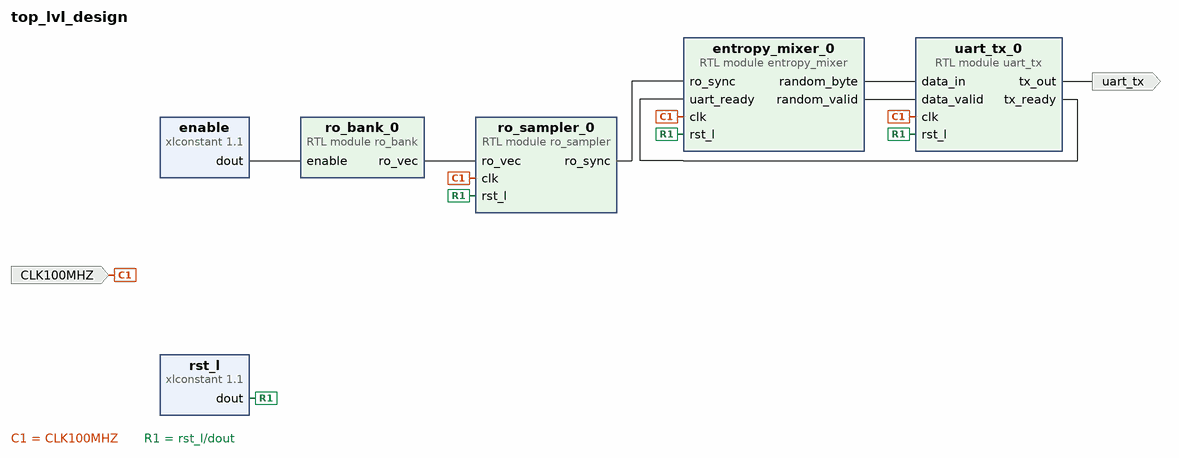
[diagram p0: block diagram of the top level]
# Vivado block design top_lvl_design, xc7s25csga324-1, Vivado 2025.2
create_bd_design top_lvl_design

create_bd_port -dir I -type clk CLK100MHZ
set_property -dict {CONFIG.FREQ_HZ 100000000} [get_bd_ports CLK100MHZ]
create_bd_port -dir O uart_tx

create_bd_cell -type module -reference ro_bank ro_bank_0
create_bd_cell -type module -reference uart_tx uart_tx_0
create_bd_cell -type module -reference ro_sampler ro_sampler_0
create_bd_cell -type ip -vlnv xilinx.com:ip:xlconstant:1.1 rst_l
set_property -dict {CONFIG.CONST_VAL 1} [get_bd_cells rst_l]
create_bd_cell -type ip -vlnv xilinx.com:ip:xlconstant:1.1 enable
create_bd_cell -type module -reference entropy_mixer entropy_mixer_0

# ---- connections ----

connect_bd_net [get_bd_ports CLK100MHZ] [get_bd_pins uart_tx_0/clk] [get_bd_pins ro_sampler_0/clk] [get_bd_pins entropy_mixer_0/clk]
connect_bd_net [get_bd_pins enable/dout] [get_bd_pins ro_bank_0/enable]
connect_bd_net [get_bd_pins entropy_mixer_0/random_byte] [get_bd_pins uart_tx_0/data_in]
connect_bd_net [get_bd_pins entropy_mixer_0/random_valid] [get_bd_pins uart_tx_0/data_valid]
connect_bd_net [get_bd_pins ro_bank_0/ro_vec] [get_bd_pins ro_sampler_0/ro_vec]
connect_bd_net [get_bd_pins ro_sampler_0/ro_sync] [get_bd_pins entropy_mixer_0/ro_sync]
connect_bd_net [get_bd_pins rst_l/dout] [get_bd_pins ro_sampler_0/rst_l] [get_bd_pins entropy_mixer_0/rst_l] [get_bd_pins uart_tx_0/rst_l]
connect_bd_net [get_bd_pins uart_tx_0/tx_out] [get_bd_ports uart_tx]
connect_bd_net [get_bd_pins uart_tx_0/tx_ready] [get_bd_pins entropy_mixer_0/uart_ready]

validate_bd_design
save_bd_design
